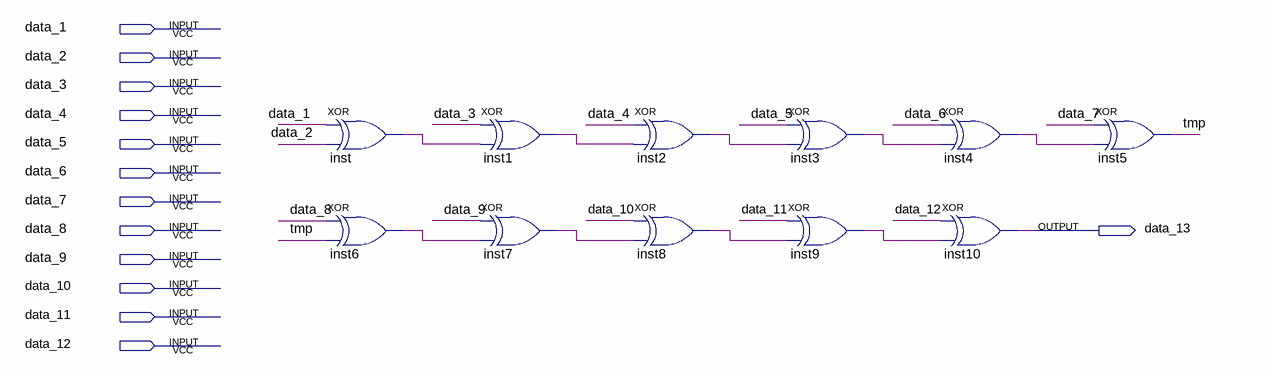
[diagram p0: schematic sheet]
// Quartus schematic paritet_bit.bdf as structural Verilog: 11 symbols, 13 pins
module paritet_bit (
  input  data_1,
  input  data_2,
  input  data_3,
  input  data_4,
  input  data_5,
  input  data_6,
  input  data_7,
  input  data_8,
  input  data_9,
  input  data_10,
  input  data_11,
  input  data_12,
  output data_13
);

  wire inst1_out, inst2_out, inst3_out, inst4_out, inst6_out, inst7_out, inst8_out, inst9_out, inst_out, tmp;

  xor inst (inst_out, data_1, data_2);
  xor inst6 (inst6_out, data_8, tmp);
  xor inst1 (inst1_out, data_3, inst_out);
  xor inst7 (inst7_out, data_9, inst6_out);
  xor inst2 (inst2_out, data_4, inst1_out);
  xor inst8 (inst8_out, data_10, inst7_out);
  xor inst3 (inst3_out, data_5, inst2_out);
  xor inst9 (inst9_out, data_11, inst8_out);
  xor inst4 (inst4_out, data_6, inst3_out);
  xor inst10 (data_13, data_12, inst9_out);
  xor inst5 (tmp, data_7, inst4_out);
endmodule
